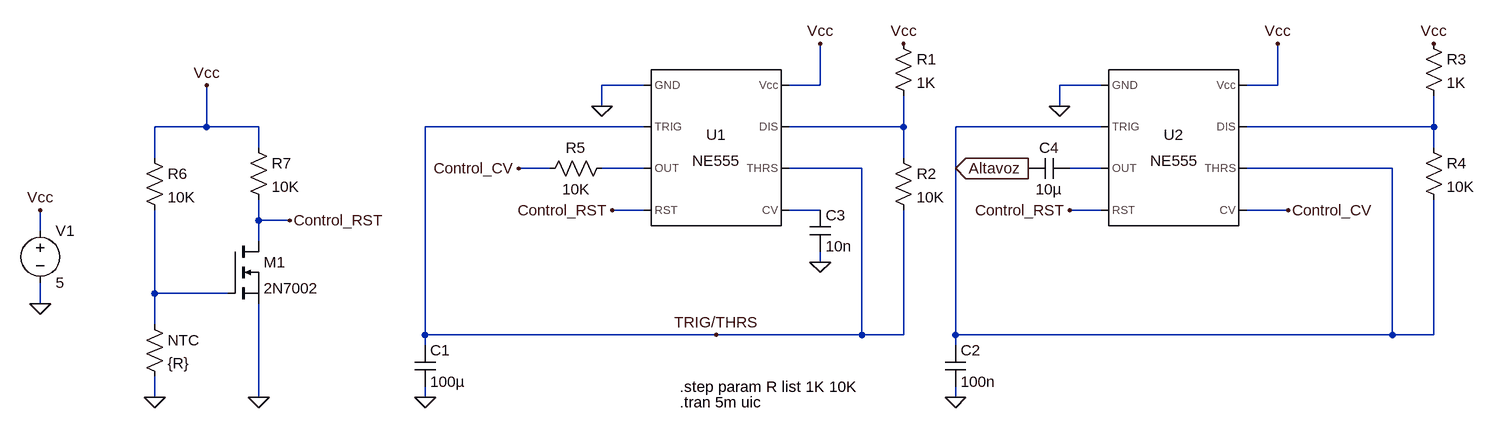
[diagram p0: schematic alarma-incendios.asc]
alarma-incendios.asc, the LTspice schematic file:
Version 4
SHEET 1 1844 680
WIRE 80 80 16 80
WIRE 352 80 352 16
WIRE 352 80 304 80
WIRE 784 80 720 80
WIRE 1056 80 1056 16
WIRE 1056 80 1008 80
WIRE 16 112 16 80
WIRE 720 112 720 80
WIRE -592 144 -592 80
WIRE -592 144 -672 144
WIRE -512 144 -592 144
WIRE 80 144 -256 144
WIRE 480 144 480 96
WIRE 480 144 304 144
WIRE 784 144 560 144
WIRE 1296 144 1296 96
WIRE 1296 144 1008 144
WIRE -512 176 -512 144
WIRE 1296 176 1296 144
WIRE -672 192 -672 144
WIRE 480 192 480 144
WIRE -64 208 -112 208
WIRE 80 208 16 208
WIRE 416 208 304 208
WIRE 784 208 736 208
WIRE 1232 208 1008 208
WIRE 80 272 32 272
WIRE 352 272 304 272
WIRE 784 272 736 272
WIRE 1072 272 1008 272
WIRE -512 288 -512 256
WIRE -464 288 -512 288
WIRE -848 304 -848 272
WIRE -512 320 -512 288
WIRE 352 352 352 336
WIRE -672 400 -672 272
WIRE -560 400 -672 400
WIRE -848 416 -848 384
WIRE -672 448 -672 400
WIRE -256 464 -256 144
WIRE 192 464 -256 464
WIRE 416 464 416 208
WIRE 416 464 192 464
WIRE 480 464 480 272
WIRE 480 464 416 464
WIRE 560 464 560 144
WIRE 1232 464 1232 208
WIRE 1232 464 560 464
WIRE 1296 464 1296 256
WIRE 1296 464 1232 464
WIRE -256 480 -256 464
WIRE 560 480 560 464
WIRE -672 560 -672 528
WIRE -512 560 -512 416
WIRE -256 560 -256 544
WIRE 560 560 560 544
FLAG -848 416 0
FLAG 352 352 0
FLAG -848 272 Vcc
FLAG 352 16 Vcc
FLAG 16 112 0
FLAG 480 16 Vcc
FLAG 192 464 TRIG/THRS
FLAG -256 560 0
FLAG -112 208 Control_CV
FLAG 1056 16 Vcc
FLAG 1296 16 Vcc
FLAG 560 560 0
FLAG 720 112 0
FLAG 672 208 Altavoz
IOPIN 672 208 Out
FLAG -672 560 0
FLAG -512 560 0
FLAG -592 80 Vcc
FLAG 1072 272 Control_CV
FLAG -464 288 Control_RST
FLAG 32 272 Control_RST
FLAG 736 272 Control_RST
SYMBOL Misc\\NE555 192 176 R0
SYMATTR InstName U1
SYMBOL voltage -848 288 R0
WINDOW 123 0 0 Left 0
WINDOW 39 0 0 Left 0
SYMATTR InstName V1
SYMATTR Value 5
SYMBOL res 464 0 R0
SYMATTR InstName R1
SYMATTR Value 1K
SYMBOL cap 336 272 R0
SYMATTR InstName C3
SYMATTR Value 10n
SYMBOL cap -272 480 R0
SYMATTR InstName C1
SYMATTR Value 100µ
SYMBOL res 464 176 R0
SYMATTR InstName R2
SYMATTR Value 10K
SYMBOL res 32 192 R90
WINDOW 0 0 56 VBottom 2
WINDOW 3 32 56 VTop 2
SYMATTR InstName R5
SYMATTR Value 10K
SYMBOL Misc\\NE555 896 176 R0
SYMATTR InstName U2
SYMBOL res 1280 0 R0
SYMATTR InstName R3
SYMATTR Value 1K
SYMBOL res 1280 160 R0
SYMATTR InstName R4
SYMATTR Value 10K
SYMBOL cap 544 480 R0
SYMATTR InstName C2
SYMATTR Value 100n
SYMBOL cap 736 192 R90
WINDOW 0 0 32 VBottom 2
WINDOW 3 32 32 VTop 2
SYMATTR InstName C4
SYMATTR Value 10µ
SYMBOL nmos -560 320 R0
SYMATTR InstName M1
SYMATTR Value 2N7002
SYMBOL res -688 176 R0
SYMATTR InstName R6
SYMATTR Value 10K
SYMBOL res -688 432 R0
SYMATTR InstName NTC
SYMATTR Value {R}
SYMBOL res -528 160 R0
SYMATTR InstName R7
SYMATTR Value 10K
TEXT 136 544 Left 2 !.step param R list 1K 10K
TEXT 136 568 Left 2 !.tran 5m uic

The netlist it stands for:
* alarma-incendios.asc
XU1 0 TRIG/THRS N004 Control_RST N006 TRIG/THRS N001 Vcc NE555  ; pins GND TRIG OUT RST CV THRS DIS Vcc
V1 Vcc 0 5
R1 Vcc N001 1K
C3 N006 0 10n
C1 TRIG/THRS 0 100µ
R2 N001 TRIG/THRS 10K
R5 N004 Control_CV 10K
XU2 0 N002 N005 Control_RST Control_CV N002 N003 Vcc NE555  ; pins GND TRIG OUT RST CV THRS DIS Vcc
R3 Vcc N003 1K
R4 N003 N002 10K
C2 N002 0 100n
C4 N005 Altavoz 10µ
M1 Control_RST N007 0 0 2N7002
R6 Vcc N007 10K
R§NTC N007 0 {R}
R7 Vcc Control_RST 10K
.model NMOS NMOS
.model PMOS PMOS
.lib standard.mos
.step param R list 1K 10K
.tran 5m uic
.lib NE555.sub
.backanno
.end